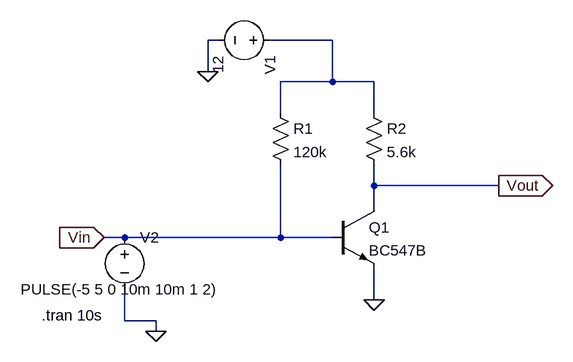
[diagram p0: schematic normallyONSwitch.asc]
normallyONSwitch.asc, the LTspice schematic file:
Version 4
SHEET 1 880 680
WIRE 80 -16 64 -16
WIRE 256 -16 160 -16
WIRE 64 32 64 -16
WIRE 256 48 256 -16
WIRE 256 48 176 48
WIRE 320 48 256 48
WIRE 176 96 176 48
WIRE 320 96 320 48
WIRE 320 208 320 176
WIRE 512 208 320 208
WIRE 320 240 320 208
WIRE -64 288 -96 288
WIRE 176 288 176 176
WIRE 176 288 -64 288
WIRE 256 288 176 288
WIRE 320 384 320 336
WIRE -64 416 -64 368
WIRE -16 416 -64 416
WIRE -16 432 -16 416
FLAG -96 288 Vin
IOPIN -96 288 In
FLAG 512 208 Vout
IOPIN 512 208 Out
FLAG 320 384 0
FLAG -16 432 0
FLAG 64 32 0
SYMBOL res 160 80 R0
SYMATTR InstName R1
SYMATTR Value 120k
SYMBOL res 304 80 R0
SYMATTR InstName R2
SYMATTR Value 5.6k
SYMBOL npn 256 240 R0
SYMATTR InstName Q1
SYMATTR Value BC547B
SYMBOL voltage 176 -16 R90
WINDOW 123 0 0 Left 0
WINDOW 39 0 0 Left 0
SYMATTR InstName V1
SYMATTR Value 12
SYMBOL voltage -64 272 R0
WINDOW 123 0 0 Left 0
WINDOW 39 0 0 Left 0
WINDOW 3 -160 96 Left 2
SYMATTR Value PULSE(-5 5 0 10m 10m 1 2)
SYMATTR InstName V2
TEXT -192 408 Left 2 !.tran 10s

The netlist it stands for:
* normallyONSwitch.asc
R1 N001 Vin 120k
R2 N001 Vout 5.6k
Q1 Vout Vin 0 0 BC547B
V1 N001 0 12
V2 Vin 0 PULSE(-5 5 0 10m 10m 1 2)
.model NPN NPN
.model PNP PNP
.lib standard.bjt
.tran 10s
.backanno
.end